# Altium schematic sheet GoodBoy_V1_nRF9160dk_MCU.SchDoc
size A3
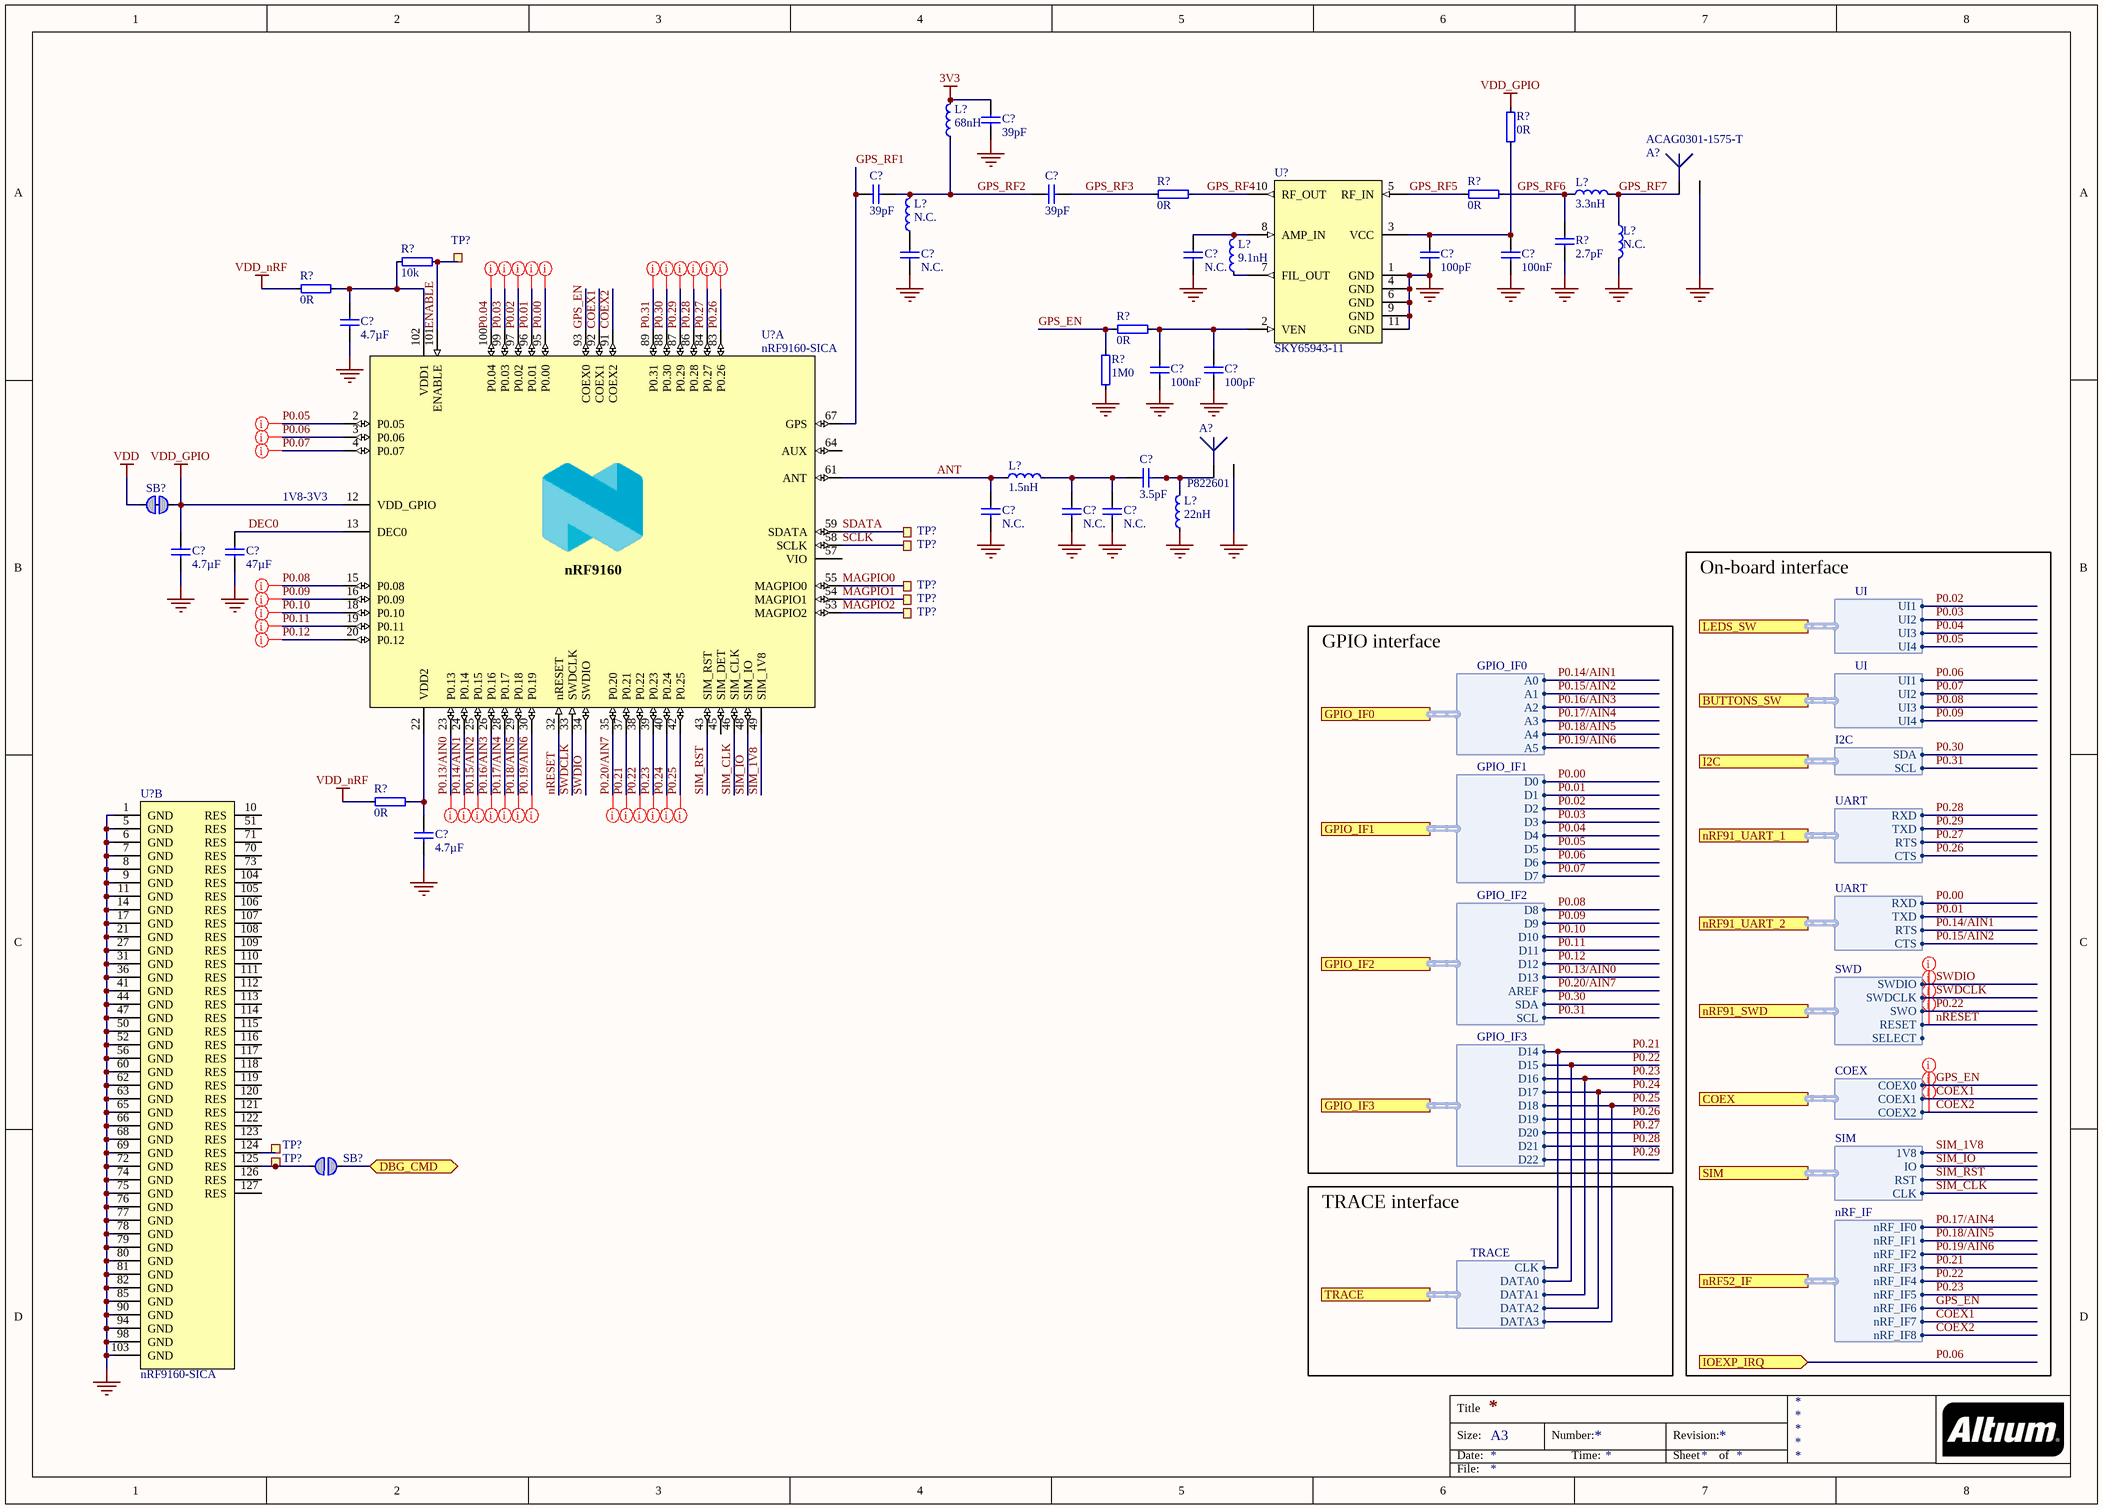
[diagram p0: GoodBoy_V1_nRF9160dk_MCU.SchDoc]

## Parts
(Parts that share a designator on the sheet are numbered #1, #2 ... from top to bottom, then left to right.)
A?#1  ACAG0301-1575-T  [ACAG0301-1575-T]
A?#2  P822601  [P822601]
C?#1  39pF  [CAPC0603X03L_C]
C?#2  39pF  [CAPC0603X03L_C]
C?#3  39pF  [CAPC0603X03L_C]
C?#4  N.C.  [CAPC0603X03L_C]
C?#5  N.C.  [CAPC0603X03L_C]
C?#6  100pF  [CAPC0603X03L_C]
C?#7  100nF  [CAPC0603X03L_C]
C?#8  4.7µF  [CAPC1005X04L]
C?#9  100nF  [CAPC0603X03L_C]
C?#10  100pF  [CAPC0603X03L_C]
C?#11  3.5pF  [CAPC0603X03L_C]
C?#12  4.7µF  [CAPC1005X04L]
C?#13  47µF  [CAPC2012X11L]
C?#14  N.C.  [CAPC0603X03L_C]
C?#15  N.C.  [CAPC0603X03L_C]
C?#16  N.C.  [CAPC0603X03L_C]
C?#17  4.7µF  [CAPC1005X04L]
L?#1  68nH  [INDC1005X04L_WW]
L?#2  N.C.  [INDC1005X04L]
L?#3  3.3nH  [INDC1005X04L_WW]
L?#4  N.C.  [INDC1005X04L]
L?#5  9.1nH  [INDC1005X04L_WW]
L?#6  1.5nH  [INDC0603X03L_C]
L?#7  22nH  [INDC0603X03L_C]
R?#1  0R  [RESC0603X03L_C]
R?#2  0R  [RESC0603X03L_C]
R?#3  0R  [RESC0603X03L_C]
R?#4  2.7pF  [CAPC1005X04L]
R?#5  10k  [RESC0603X03L_C]
R?#6  0R  [RESC0603X03L_C]
R?#7  0R  [RESC0603X03L_C]
R?#8  1M0  [RESC0603X03L_C]
R?#9  0R  [RESC0603X03L_C]
SB?#1  Solderbridge  [Solderbridge_Shorted]  (value not drawn)  (net tie, no BOM)
SB?#2  Solderbridge  [Solderbridge]  (value not drawn)  (no BOM)
TP?#1  Ø1.5mm,SMD  [TP_SMD_Ø1.5mm]  (value not drawn)  (no BOM)
TP?#2  Ø1.0mm,SMD  [TP_SMD_Ø1.0mm]  (value not drawn)  (no BOM)
TP?#3  Ø1.0mm,SMD  [TP_SMD_Ø1.0mm]  (value not drawn)  (no BOM)
TP?#4  Ø1.0mm,SMD  [TP_SMD_Ø1.0mm]  (value not drawn)  (no BOM)
TP?#5  Ø1.0mm,SMD  [TP_SMD_Ø1.0mm]  (value not drawn)  (no BOM)
TP?#6  Ø1.0mm,SMD  [TP_SMD_Ø1.0mm]  (value not drawn)  (no BOM)
TP?#7  Ø1.0mm,SMD  [TP_SMD_Ø1.0mm]  (value not drawn)  (no BOM)
TP?#8  Ø1.0mm,SMD  [TP_SMD_Ø1.0mm]  (value not drawn)  (no BOM)
U?#1  SKY65943-11  [SKY65943-11]
U?#2  nRF9160-SICA  [LGA50P1600X1050X104-161N]  (part A of 2)
U?#3  nRF9160-SICA  [LGA50P1600X1050X104-161N]  (part B of 2)

## Ports
BUTTONS_SW (harness UI), COEX (harness COEX), DBG_CMD (bidir), GPIO_IF0 (harness GPIO_IF0), GPIO_IF1 (harness GPIO_IF1), GPIO_IF2 (harness GPIO_IF2), GPIO_IF3 (harness GPIO_IF3), I2C (harness I2C), IOEXP_IRQ (in), LEDS_SW (harness UI), nRF52_IF (harness nRF_IF), nRF91_SWD (harness SWD), nRF91_UART_1 (harness UART), nRF91_UART_2 (harness UART), SIM (harness SIM), TRACE (harness TRACE)

## Harnesses
COEX: COEX0, COEX2, COEX1
UART: RTS, CTS, RXD, TXD
SIM: CLK, IO, 1V8, RST
SWD: SWDIO, SWDCLK, SWO, RESET, SELECT
I2C: SCL, SDA
UI: UI4, UI3, UI2, UI1
nRF_IF: nRF_IF0, nRF_IF1, nRF_IF2, nRF_IF3, nRF_IF4, nRF_IF5, nRF_IF6, nRF_IF7, nRF_IF8
GPIO_IF1: D0, D1, D2, D3, D4, D5, D6, D7
GPIO_IF2: D8, D9, D10, D11, D12, D13, AREF, SDA, SCL
GPIO_IF0: A0, A1, A2, A3, A4, A5
GPIO_IF3: D14, D15, D16, D17, D18, D19, D20, D21, D22
TRACE: CLK, DATA0, DATA1, DATA3, DATA2

## Nets
3V3: C?#1.2 L?#1.1
GND: A?#1.2 A?#2.2 C?#1.1 C?#4.2 C?#5.1 C?#6.1 C?#7.1 C?#8.2 C?#9.1 C?#10.1 C?#12.2 C?#13.2 C?#14.1 C?#15.1 C?#16.1 C?#17.1 L?#4.2 L?#7.1 R?#4.2 R?#8.1 U?#1.1(GND) U?#1.4(GND) U?#1.6(GND) U?#1.9(GND) U?#1.11(GND) U?#3.1(GND) U?#3.5(GND) U?#3.6(GND) U?#3.7(GND) U?#3.8(GND) U?#3.9(GND) U?#3.11(GND) U?#3.14(GND) U?#3.17(GND) U?#3.21(GND) U?#3.27(GND) U?#3.31(GND) U?#3.36(GND) U?#3.41(GND) U?#3.44(GND) U?#3.47(GND) U?#3.50(GND) U?#3.52(GND) U?#3.56(GND) U?#3.60(GND) U?#3.62(GND) U?#3.63(GND) U?#3.65(GND) U?#3.66(GND) U?#3.68(GND) U?#3.69(GND) U?#3.72(GND) U?#3.74(GND) U?#3.75(GND) U?#3.76(GND) U?#3.77(GND) U?#3.78(GND) U?#3.79(GND) U?#3.80(GND) U?#3.81(GND) U?#3.82(GND) U?#3.85(GND) U?#3.90(GND) U?#3.94(GND) U?#3.98(GND) U?#3.103(GND)
VDD: SB?#1.1
VDD_GPIO: C?#12.1 R?#1.2 SB?#1.2 U?#2.12(VDD_GPIO)
VDD_nRF: R?#6.1 R?#9.1
ANT: C?#14.2 L?#6.1 U?#2.61(ANT)
COEX1: U?#2.92(COEX1) ; port COEX.COEX1, port nRF52_IF.nRF_IF7
COEX2: U?#2.91(COEX2) ; port COEX.COEX2, port nRF52_IF.nRF_IF8
DBG_CMD: SB?#2.1 ; port DBG_CMD
DEC0: C?#13.1 U?#2.13(DEC0)
ENABLE: R?#5.2 TP?#1.1 U?#2.101(ENABLE)
GPS_EN: R?#7.1 R?#8.2 U?#2.93(COEX0) ; port COEX.COEX0, port nRF52_IF.nRF_IF6
GPS_RF1: C?#2.2 U?#2.67(GPS)
GPS_RF2: C?#2.1 C?#3.2 L?#1.2 L?#2.1
GPS_RF3: C?#3.1 R?#2.1
GPS_RF4: R?#2.2 U?#1.10(RF_OUT)
GPS_RF5: R?#3.1 U?#1.5(RF_IN)
GPS_RF6: L?#3.1 R?#3.2 R?#4.1
GPS_RF7: A?#1.1 L?#3.2 L?#4.1
MAGPIO0: TP?#4.1 U?#2.55(MAGPIO0)
MAGPIO1: TP?#5.1 U?#2.54(MAGPIO1)
MAGPIO2: TP?#6.1 U?#2.53(MAGPIO2)
nRESET: U?#2.32(nRESET) ; port nRF91_SWD.RESET
P0.00: U?#2.95(P0.00) ; port nRF91_UART_2.RXD, port GPIO_IF1.D0
P0.01: U?#2.96(P0.01) ; port nRF91_UART_2.TXD, port GPIO_IF1.D1
P0.02: U?#2.97(P0.02) ; port LEDS_SW.UI1, port GPIO_IF1.D2
P0.03: U?#2.99(P0.03) ; port LEDS_SW.UI2, port GPIO_IF1.D3
P0.04: U?#2.100(P0.04) ; port LEDS_SW.UI3, port GPIO_IF1.D4
P0.05: U?#2.2(P0.05) ; port LEDS_SW.UI4, port GPIO_IF1.D5
P0.06: U?#2.3(P0.06) ; port IOEXP_IRQ, port BUTTONS_SW.UI1, port GPIO_IF1.D6
P0.07: U?#2.4(P0.07) ; port BUTTONS_SW.UI2, port GPIO_IF1.D7
P0.08: U?#2.15(P0.08) ; port BUTTONS_SW.UI3, port GPIO_IF2.D8
P0.09: U?#2.16(P0.09) ; port BUTTONS_SW.UI4, port GPIO_IF2.D9
P0.10: U?#2.18(P0.10) ; port GPIO_IF2.D10
P0.11: U?#2.19(P0.11) ; port GPIO_IF2.D11
P0.12: U?#2.20(P0.12) ; port GPIO_IF2.D12
P0.13/AIN0: U?#2.23(P0.13) ; port GPIO_IF2.D13
P0.14/AIN1: U?#2.24(P0.14) ; port nRF91_UART_2.RTS, port GPIO_IF0.A0
P0.15/AIN2: U?#2.25(P0.15) ; port nRF91_UART_2.CTS, port GPIO_IF0.A1
P0.16/AIN3: U?#2.26(P0.16) ; port GPIO_IF0.A2
P0.17/AIN4: U?#2.28(P0.17) ; port nRF52_IF.nRF_IF0, port GPIO_IF0.A3
P0.18/AIN5: U?#2.29(P0.18) ; port nRF52_IF.nRF_IF1, port GPIO_IF0.A4
P0.19/AIN6: U?#2.30(P0.19) ; port nRF52_IF.nRF_IF2, port GPIO_IF0.A5
P0.20/AIN7: U?#2.35(P0.20) ; port GPIO_IF2.AREF
P0.21: U?#2.37(P0.21) ; port nRF52_IF.nRF_IF3, port GPIO_IF3.D14, port TRACE.CLK
P0.22: U?#2.38(P0.22) ; port nRF91_SWD.SWO, port nRF52_IF.nRF_IF4, port GPIO_IF3.D15, port TRACE.DATA0
P0.23: U?#2.39(P0.23) ; port nRF52_IF.nRF_IF5, port GPIO_IF3.D16, port TRACE.DATA1
P0.24: U?#2.40(P0.24) ; port GPIO_IF3.D17, port TRACE.DATA2
P0.25: U?#2.42(P0.25) ; port GPIO_IF3.D18, port TRACE.DATA3
P0.26: U?#2.83(P0.26) ; port nRF91_UART_1.CTS, port GPIO_IF3.D19
P0.27: U?#2.84(P0.27) ; port nRF91_UART_1.RTS, port GPIO_IF3.D20
P0.28: U?#2.86(P0.28) ; port nRF91_UART_1.RXD, port GPIO_IF3.D21
P0.29: U?#2.87(P0.29) ; port nRF91_UART_1.TXD, port GPIO_IF3.D22
P0.30: U?#2.88(P0.30) ; port I2C.SDA, port GPIO_IF2.SDA
P0.31: U?#2.89(P0.31) ; port I2C.SCL, port GPIO_IF2.SCL
SCLK: TP?#3.1 U?#2.58(SCLK)
SDATA: TP?#2.1 U?#2.59(SDATA)
SIM_1V8: U?#2.49(SIM_1V8) ; port SIM.1V8
SIM_CLK: U?#2.46(SIM_CLK) ; port SIM.CLK
SIM_IO: U?#2.48(SIM_IO) ; port SIM.IO
SIM_RST: U?#2.43(SIM_RST) ; port SIM.RST
SWDCLK: U?#2.33(SWDCLK) ; port nRF91_SWD.SWDCLK
SWDIO: U?#2.34(SWDIO) ; port nRF91_SWD.SWDIO
NetA?#2_1: A?#2.1 C?#11.2 L?#7.2
NetC?#4_1: C?#4.1 L?#5.1 U?#1.8(AMP_IN)
NetC?#5_2: C?#5.2 L?#2.2
NetC?#6_2: C?#6.2 C?#7.2 R?#1.1 U?#1.3(VCC)
NetC?#8_1: C?#8.1 R?#5.1 R?#6.2 U?#2.102(VDD1)
NetC?#9_2: C?#9.2 C?#10.2 R?#7.2 U?#1.2(VEN)
NetC?#11_1: C?#11.1 C?#15.2 C?#16.2 L?#6.2
NetC?#17_2: C?#17.2 R?#9.2 U?#2.22(VDD2)
NetL?#5_2: L?#5.2 U?#1.7(FIL_OUT)
NetSB?#2_2: SB?#2.2 TP?#8.1 U?#3.125(RES)
NetTP?#7_1: TP?#7.1 U?#3.124(RES)

Not connected (* = marked no-connect by the designer): U?#2 45(SIM_DET) 57(VIO) 64(AUX); U?#3 10(RES) 51(RES) 70(RES) 71(RES) 73(RES) 104(RES) 105(RES) 106(RES) 107(RES) 108(RES) 109(RES) 110(RES) 111(RES) 112(RES) 113(RES) 114(RES) 115(RES) 116(RES) 117(RES) 118(RES) 119(RES) 120(RES) 121(RES) 122(RES) 123(RES) 126(RES) 127(RES)

## Layout directives
net class SWD: nRESET, P0.22, SWDCLK, SWDIO
net class COEX: COEX1, COEX2, GPS_EN
net class GPIO: P0.00, P0.01, P0.02, P0.03, P0.04, P0.05, P0.06, P0.07, P0.08, P0.09, P0.10, P0.11, P0.12, P0.13/AIN0, P0.14/AIN1, P0.15/AIN2, P0.16/AIN3, P0.17/AIN4, P0.18/AIN5, P0.19/AIN6, P0.20/AIN7, P0.21, P0.22, P0.23, P0.24, P0.25, P0.26, P0.27, P0.28, P0.29, P0.30, P0.31

## Notes on the sheet
- 1V8-3V3
- On-board interface
- GPIO interface
- TRACE interface
- Title
- Size:
- Date:
- A3
- Number:
- Time:
- Revision:
- Sheet
- of
- File:
- (in symbol nRF9160_SICA, part A) nRF9160

## Library data of the parts
A?#1 = ACAG0301-1575-T: RF ANT 1.575GHZ CHIP SOLDER SMD; Manufacturer: Abracon; Artikkelnr Noca: N.A.; Part Number: ACAG0301-1575-T; Manufacturer Part Number: ACAG0301-1575-T; ComponentLink1URL: https://abracon.com/datasheets/ACAG0301-1575-T.pdf; ComponentLink1Description: Datasheet; ComponentLink2URL: *; ComponentLink2Description: Supplier link; HelpURL: *; Footprint Doc: ACAG0301-1575-T; LatestRevisionDate: 2018-12-01; Pin Count: 2; Publisher: Nordic Semiconductor; Published: 2018-12-01; Value: ACAG0301-1575-T; Note: *; Supplier 1: Digi-Key; Supplier Part Number 1: 535-14486-1-ND; Supplier 2: Mouser; Supplier Part Number 2: 815-G0301-1575-T; Part number IPS: N.A.
A?#2 = P822601: ANTENNA PRESTTA OCTABAND LTE; Manufacturer: Ethertronics; Part number IPS: 00000009001; Artikkelnr Noca: N.A.; Part Number: P822601; Manufacturer Part Number: P822601; Footprint Doc: P822601; LatestRevisionDate: 2017-07-28; Pin Count: 2; Publisher: Nordic Semiconductor; Published: 2017-07-28; Value: P822601; Note: *; ComponentLink1URL: *; ComponentLink1Description: Datasheet; ComponentLink2URL: *; ComponentLink2Description: Supplier link; HelpURL: http://www.ethertronics.com/wp-content/uploads/2016/11/Prestta-P822601-P822602-Standard-Cellular-Octa-Band-20160904.pdf; Supplier 1: moreelectronics.dk; Supplier Part Number 1: P822601; Supplier 2: Digikey; Supplier Part Number 2: 939-1057-1-ND
C?#1-C?#3 = C0201-39p: Capacitor, NP0, ±1%, 25V; Part number IPS: 00000001668; Artikkelnr Noca: N.A.; Part Number: C0201-39p; Manufacturer: *; Manufacturer Part Number: *; ComponentLink1URL: *; ComponentLink1Description: Datasheet; ComponentLink2URL: *; ComponentLink2Description: Supplier link; HelpURL: *; Footprint Doc: 0201; LatestRevisionDate: 2014-11-13; Pin Count: 2; Publisher: Nordic Semiconductor; Published: 2014-11-13; Value: 39pF; Note: 25V; Supplier 1: *; Supplier Part Number 1: *; Supplier 2: *; Supplier Part Number 2: *
C?#4 C?#5 = C0201-N.C.: Not mounted; Assembly: Not mounted; Note: Chip Cap; Artikkelnr Noca: N.A.; Part Number: C0201-N.C.; Manufacturer: *; Manufacturer Part Number: *; ComponentLink1URL: *; ComponentLink1Description: Datasheet; ComponentLink2URL: *; ComponentLink2Description: Supplier link; HelpURL: *; Footprint Doc: 0201; LatestRevisionDate: 2014-11-13; Pin Count: 2; Publisher: Nordic Semiconductor; Published: 2014-11-13; Value: N.C.; Supplier 1: *; Supplier Part Number 1: *; Supplier 2: *; Supplier Part Number 2: *; Part number IPS: N.A.
C?#6 C?#10 = C0201-100p: Capacitor, NP0, ±2%, 25V; Part number IPS: 00000007853; Artikkelnr Noca: N.A.; Part Number: C0201-100p; Manufacturer: *; Manufacturer Part Number: *; ComponentLink1URL: *; ComponentLink1Description: Datasheet; ComponentLink2URL: *; ComponentLink2Description: Supplier link; HelpURL: *; Footprint Doc: 0201; LatestRevisionDate: 2019-04-16; Pin Count: 2; Publisher: Nordic Semiconductor; Published: 2019-04-16; Value: 100pF; Note: 25V; Supplier 1: *; Supplier Part Number 1: *; Supplier 2: *; Supplier Part Number 2: *
C?#7 C?#9 = C0201-100n: Capacitor, X5R, ±10%; Part number IPS: 00000001248; Note: 16V; Artikkelnr Noca: N.A.; Part Number: C0201-100n; Manufacturer: *; Manufacturer Part Number: *; ComponentLink1URL: *; ComponentLink1Description: Datasheet; ComponentLink2URL: *; ComponentLink2Description: Supplier link; HelpURL: *; Footprint Doc: 0201; LatestRevisionDate: 2017-11-09; Pin Count: 2; Publisher: Nordic Semiconductor; Published: 2014-11-13; Value: 100nF; Supplier 1: *; Supplier Part Number 1: *; Supplier 2: *; Supplier Part Number 2: *
C?#8 C?#12 C?#17 = C0402-4µ7: Capacitor, X5R, ±20%; Part number IPS: 00000001251; Note: 10V; Artikkelnr Noca: 20039482; Part Number: C0402-4µ7; Manufacturer: *; Manufacturer Part Number: *; ComponentLink1URL: *; ComponentLink1Description: Datasheet; ComponentLink2URL: *; ComponentLink2Description: Supplier link; HelpURL: *; Footprint Doc: 0402; LatestRevisionDate: 2017-11-09; Pin Count: 2; Publisher: Nordic Semiconductor; Published: 2009-05-08; Value: 4.7µF; Supplier 1: Digi-Key; Supplier Part Number 1: 490-13252-1-ND; Supplier 2: *; Supplier Part Number 2: *
C?#11 = C0201-3.5p: Capacitor, NP0, ±0.1pF, 25V; Manufacturer: Murata; Manufacturer Part Number: GJM0335C1H3R5BB01E; Part number IPS: 00000001469; Artikkelnr Noca: N.A.; Part Number: C0201-3.5p; ComponentLink1URL: *; ComponentLink1Description: Datasheet; ComponentLink2URL: *; ComponentLink2Description: Supplier link; HelpURL: *; Footprint Doc: 0201; LatestRevisionDate: 2019-02-22; Pin Count: 2; Publisher: Nordic Semiconductor; Published: 2019-02-22; Value: 3.5pF; Note: 25V; Supplier 1: *; Supplier Part Number 1: *; Supplier 2: *; Supplier Part Number 2: *
C?#13 = C0805-47µ: Capacitor, X5R, ±20%, 6.3V; Manufacturer: Taiyo Yuden; Manufacturer Part Number: JMK212BJ476MG-T; Artikkelnr Noca: N.A.; Part Number: C0805-47µ; ComponentLink1URL: https://www.yuden.co.jp/productdata/catalog/mlcc01_e.pdf; ComponentLink1Description: Datasheet; ComponentLink2URL: *; ComponentLink2Description: Supplier link; HelpURL: https://ds.yuden.co.jp/TYCOMPAS/eu/detail?u=M&pn=JMK212BBJ476MG-T; Footprint Doc: 0805; LatestRevisionDate: 2019-03-15; Pin Count: 2; Publisher: Nordic Semiconductor; Published: 2019-03-15; Value: 47µF; Note: 6.3V; Part number IPS: N.A.; Supplier 1: Digi-Key; Supplier Part Number 1: 587-1779-2-ND; Supplier 2: *; Supplier Part Number 2: *
C?#14-C?#16 = C0201-N.C.: Not mounted; Note: Chip Cap; Artikkelnr Noca: N.A.; Assembly: Not mounted; Part Number: C0201-N.C.; Manufacturer: *; Manufacturer Part Number: *; ComponentLink1URL: *; ComponentLink1Description: Datasheet; ComponentLink2URL: *; ComponentLink2Description: Supplier link; HelpURL: *; Footprint Doc: 0201; LatestRevisionDate: 2014-11-13; Pin Count: 2; Publisher: Nordic Semiconductor; Published: 2014-11-13; Value: N.C.; Part number IPS: N.A.; Supplier 1: *; Supplier Part Number 1: *; Supplier 2: *; Supplier Part Number 2: *
L?#1 = L0402-68n-Wirewound-Murata: Inductor, 140mA, ±2%, 1960mΩ, Q=20; Manufacturer: Murata; Manufacturer Part Number: LQW15AN68NG00; Note: -55°C ~ 125°C; Artikkelnr Noca: N.A.; Part Number: L0402-68n-Wirewound-Murata; ComponentLink1URL: https://search.murata.co.jp/Ceramy/image/img/P02/JELF243A-0050.pdf; ComponentLink1Description: Datasheet; ComponentLink2URL: *; ComponentLink2Description: Supplier link; HelpURL: https://psearch.en.murata.com/inductor/product/LQW15AN68NG00%23.html; Footprint Doc: 0402; LatestRevisionDate: 2019-04-16; Pin Count: 2; Publisher: Nordic Semiconductor; Published: 2019-04-16; Value: 68nH; Supplier 1: Digi-Key; Supplier Part Number 1: 490-6837-1-ND; Supplier 2: *; Supplier Part Number 2: *; Part number IPS: N.A.
L?#2 L?#4 = L0402-N.C.: Not mounted; Assembly: Not mounted; Artikkelnr Noca: N.A.; Part Number: L0402-N.C.; Manufacturer: *; Manufacturer Part Number: *; ComponentLink1URL: *; ComponentLink1Description: Datasheet; ComponentLink2URL: *; ComponentLink2Description: Supplier link; HelpURL: *; Footprint Doc: 0402; LatestRevisionDate: 2016-11-24; Pin Count: 2; Publisher: Nordic Semiconductor; Published: 2016-11-24; Value: N.C.; Note: *; Supplier 1: *; Supplier Part Number 1: *; Supplier 2: *; Supplier Part Number 2: *; Part number IPS: N.A.
L?#3 = L0402-3n3-Wirewound-Murata: Inductor, 900mA, ±0.5nH, 40mΩ, Q=30; Manufacturer: Murata; Manufacturer Part Number: LQW15AN3N3D10; Note: -55°C ~ 125°C; Artikkelnr Noca: N.A.; Part Number: L0402-3n3-Wirewound-Murata; ComponentLink1URL: https://search.murata.co.jp/Ceramy/image/img/P02/JELF243A-0051.pdf; ComponentLink1Description: Datasheet; ComponentLink2URL: *; ComponentLink2Description: Supplier link; HelpURL: https://psearch.en.murata.com/inductor/product/LQW15AN3N3D10%23.html; Footprint Doc: 0402; LatestRevisionDate: 2019-04-16; Pin Count: 2; Publisher: Nordic Semiconductor; Published: 2019-04-16; Value: 3.3nH; Supplier 1: Digi-Key; Supplier Part Number 1: 490-6809-1-ND; Supplier 2: *; Supplier Part Number 2: *; Part number IPS: N.A.
L?#5 = L0402-9n1-Wirewound-Murata: Inductor, 540mA, ±2%, 140mΩ, Q=25; Manufacturer: Murata; Manufacturer Part Number: LQW15AN9N1G00; Note: -55°C ~ 125°C; Artikkelnr Noca: N.A.; Part Number: L0402-9n1-Wirewound-Murata; ComponentLink1URL: https://search.murata.co.jp/Ceramy/image/img/P02/JELF243A-0050.pdf; ComponentLink1Description: Datasheet; ComponentLink2URL: *; ComponentLink2Description: Supplier link; HelpURL: https://psearch.en.murata.com/inductor/product/LQW15AN9N1G00%23.html; Footprint Doc: 0402; LatestRevisionDate: 2019-04-16; Pin Count: 2; Publisher: Nordic Semiconductor; Published: 2019-04-16; Value: 9.1nH; Supplier 1: Digi-Key; Supplier Part Number 1: 490-6854-1-ND; Supplier 2: *; Supplier Part Number 2: *; Part number IPS: N.A.
L?#6 = L0201-1n5: Inductor, 650mA, ±0.1nH; Manufacturer: Murata; Manufacturer Part Number: LQP03TQ1N5B02D; Part number IPS: 00000000836; Artikkelnr Noca: N.A.; Part Number: L0201-1n5; ComponentLink1URL: *; ComponentLink1Description: Datasheet; ComponentLink2Description: Supplier link; HelpURL: *; Footprint Doc: 0201; LatestRevisionDate: 2013-04-10; Pin Count: 2; Publisher: Nordic Semiconductor; Published: 2013-04-10; Value: 1.5nH; Note: *; ComponentLink2URL: *; Supplier 1: *; Supplier Part Number 1: *; Supplier 2: *; Supplier Part Number 2: *
L?#7 = L0201-22n: Chip Inductor; Note: High frequency chip inductor ±10%; Artikkelnr Noca: N.A.; Part Number: L0201-22n; Manufacturer: *; Manufacturer Part Number: *; ComponentLink1URL: *; ComponentLink1Description: Datasheet; ComponentLink2Description: Supplier link; HelpURL: *; Footprint Doc: 0201; LatestRevisionDate: 2013-04-10; Pin Count: 2; Publisher: Nordic Semiconductor; Published: 2013-04-10; Value: 22nH; Part number IPS: N.A.; ComponentLink2URL: *; Supplier 1: *; Supplier Part Number 1: *; Supplier 2: *; Supplier Part Number 2: *
R?#1-R?#3 R?#6 R?#7 R?#9 = R0201-0R: Resistor, ±5%, 0.05W; Part number IPS: 00000003245; Note: Chip Res 5%; Artikkelnr Noca: N.A.; Part Number: R0201-0R; Manufacturer: *; Manufacturer Part Number: *; ComponentLink1URL: *; ComponentLink1Description: Datasheet; ComponentLink2URL: *; ComponentLink2Description: Supplier link; HelpURL: *; Footprint Doc: 0201; LatestRevisionDate: 2017-11-09; Pin Count: 2; Publisher: Nordic Semiconductor; Published: 2014-11-13; Value: 0R; Supplier 1: *; Supplier Part Number 1: *; Supplier 2: *; Supplier Part Number 2: *
R?#4 = C0402-2.7p: Chip Cap 0402; Note: Chip Cap 1%; Artikkelnr Noca: N.A.; Part Number: C0402-2.7p; Manufacturer: *; Manufacturer Part Number: *; ComponentLink1URL: *; ComponentLink1Description: Datasheet; ComponentLink2URL: *; ComponentLink2Description: Supplier link; HelpURL: *; Footprint Doc: 0402; LatestRevisionDate: 2009-05-08; Pin Count: 2; Publisher: Nordic Semiconductor; Published: 2009-05-08; Value: 2.7pF; Supplier 1: *; Supplier Part Number 1: *; Supplier 2: *; Supplier Part Number 2: *; Part number IPS: N.A.
R?#5 = R0201-10k: Resistor, ±1%, 0.05W; Part number IPS: 00000001255; Note: Chip Res 1%; Artikkelnr Noca: N.A.; Part Number: R0201-10k; Manufacturer: *; Manufacturer Part Number: *; ComponentLink1URL: *; ComponentLink1Description: Datasheet; ComponentLink2URL: *; ComponentLink2Description: Supplier link; HelpURL: *; Footprint Doc: 0201; LatestRevisionDate: 2014-11-13; Pin Count: 2; Publisher: Nordic Semiconductor; Published: 2014-11-13; Value: 10k; Supplier 1: *; Supplier Part Number 1: *; Supplier 2: *; Supplier Part Number 2: *
R?#8 = R0201-1M0: Resistor, ±1%, 0.05W; Part number IPS: 00000001418; Note: Chip Res 1%; Artikkelnr Noca: N.A.; Part Number: R0201-1M0; Manufacturer: *; Manufacturer Part Number: *; ComponentLink1URL: *; ComponentLink1Description: Datasheet; ComponentLink2URL: *; ComponentLink2Description: Supplier link; HelpURL: *; Footprint Doc: 0201; LatestRevisionDate: 2014-11-13; Pin Count: 2; Publisher: Nordic Semiconductor; Published: 2014-11-13; Value: 1M0; Supplier 1: *; Supplier Part Number 1: *; Supplier 2: *; Supplier Part Number 2: *
SB?#1 = Solderbridge Shorted: Shorted Solderbridge; Artikkelnr Noca: N.A.; Part Number: Solderbridge Shorted; Manufacturer: *; Manufacturer Part Number: *; LatestRevisionDate: 2012-08-07; Pin Count: 2; Publisher: Nordic Semiconductor; Published: 2012-08-07; Value: Solderbridge; Note: *; Footprint Doc: Solderbridge_Shorted; Part number IPS: N.A.; ComponentLink1URL: *; ComponentLink1Description: Datasheet; ComponentLink2URL: *; ComponentLink2Description: Supplier link; HelpURL: *; Supplier 1: *; Supplier Part Number 1: *; Supplier 2: *; Supplier Part Number 2: *
SB?#2 = Solderbridge: Artikkelnr Noca: N.A.; Part Number: Solderbridge; Manufacturer: *; Manufacturer Part Number: *; LatestRevisionDate: 2009-12-14; Pin Count: 2; Publisher: Nordic Semiconductor; Published: 2009-12-14; Value: Solderbridge; Note: *; Footprint Doc: Solderbridge; Part number IPS: N.A.; ComponentLink1URL: *; ComponentLink1Description: Datasheet; ComponentLink2URL: *; ComponentLink2Description: Supplier link; HelpURL: *; Supplier 1: *; Supplier Part Number 1: *; Supplier 2: *; Supplier Part Number 2: *
TP?#1 = TP_SMD_Ø1.5MM: 1.0mm circular SMD testpad; Manufacturer: Nordic Semiconductor; Artikkelnr Noca: N.A.; Part Number: TP_SMD_Ø1.5MM; Manufacturer Part Number: *; ComponentLink1URL: *; ComponentLink1Description: Datasheet; ComponentLink2URL: *; ComponentLink2Description: Supplier link; HelpURL: *; Footprint Doc: TP_SMD_Ø1.5mm; LatestRevisionDate: 2016-06-02; Pin Count: 1; Publisher: Nordic Semiconductor; Published: 2016-06-02; Value: Ø1.5mm,SMD; Note: *; Part number IPS: N.A.; Supplier 1: *; Supplier Part Number 1: *; Supplier 2: *; Supplier Part Number 2: *
TP?#2-TP?#8 = TP_SMD_Ø1.0MM: 1.0mm circular SMD testpad; Manufacturer: Nordic Semiconductor; Artikkelnr Noca: N.A.; Part Number: TP_SMD_Ø1.0MM; Manufacturer Part Number: *; ComponentLink1URL: *; ComponentLink1Description: Datasheet; ComponentLink2URL: *; ComponentLink2Description: Supplier link; HelpURL: *; Footprint Doc: TP_SMD_Ø1.0mm; LatestRevisionDate: 2013-06-11; Pin Count: 1; Publisher: Nordic Semiconductor; Published: 2013-06-11; Value: Ø1.0mm,SMD; Note: *; Part number IPS: N.A.; Supplier 1: *; Supplier Part Number 1: *; Supplier 2: *; Supplier Part Number 2: *
U?#1 = SKY65943-11: GNSS Low-Noise Amplifier Front-End Module with Integrated Pre-Filter and Post-Filter; Manufacturer: Skyworks; Artikkelnr Noca: N.A.; Part Number: SKY65943-11; Manufacturer Part Number: SKY65943-11; Footprint Doc: MCM-10; Pin Count: 10; Value: SKY65943-11; ComponentLink1URL: http://www.skyworksinc.com/uploads/documents/SKY65943_11_204404F.pdf; ComponentLink1Description: Datasheet; ComponentLink2URL: https://www.digikey.com/product-detail/en/skyworks-solutions-inc/SKY65943-11/863-2032-1-ND; ComponentLink2Description: Supplier link; HelpURL: http://www.skyworksinc.com/Product/3579/SKY65943-11; LatestRevisionDate: 2019-04-16; Publisher: Nordic Semiconductor; Published: 2019-04-16; Note: *; Supplier 1: Digi-Key; Supplier Part Number 1: 863-2032-1-ND; Supplier 2: Mouser; Supplier Part Number 2: 873-SKY65943-11; Part number IPS: N.A.
U?#2 U?#3 = nRF9160_SICA: Low power System-in-Package with integrated LTE-M/NB-IoT modem and GPS; Part Number: nRF9160-SICAB00; Manufacturer: Nordic Semiconductor; Artikkelnr Noca: N.A.; Manufacturer Part Number: nRF9160-SICAB00; Footprint Doc: LGA-161; Pin Count: 161; Value: nRF9160-SICA; ComponentLink1URL: *; ComponentLink1Description: Datasheet; ComponentLink2URL: *; ComponentLink2Description: Supplier link; HelpURL: *; LatestRevisionDate: 2019-03-01; Publisher: Nordic Semiconductor; Published: 2019-03-01; Note: *; Supplier 1: Nordic Semiconductor; Supplier Part Number 1: nRF9160-SICAB00; Supplier 2: *; Supplier Part Number 2: *; Part number IPS: N.A.